# Altium schematic sheet Logic_IO_Protection.SchDoc
size 420 x 297 mm; SheetNumber: 4; SheetTotal: 5
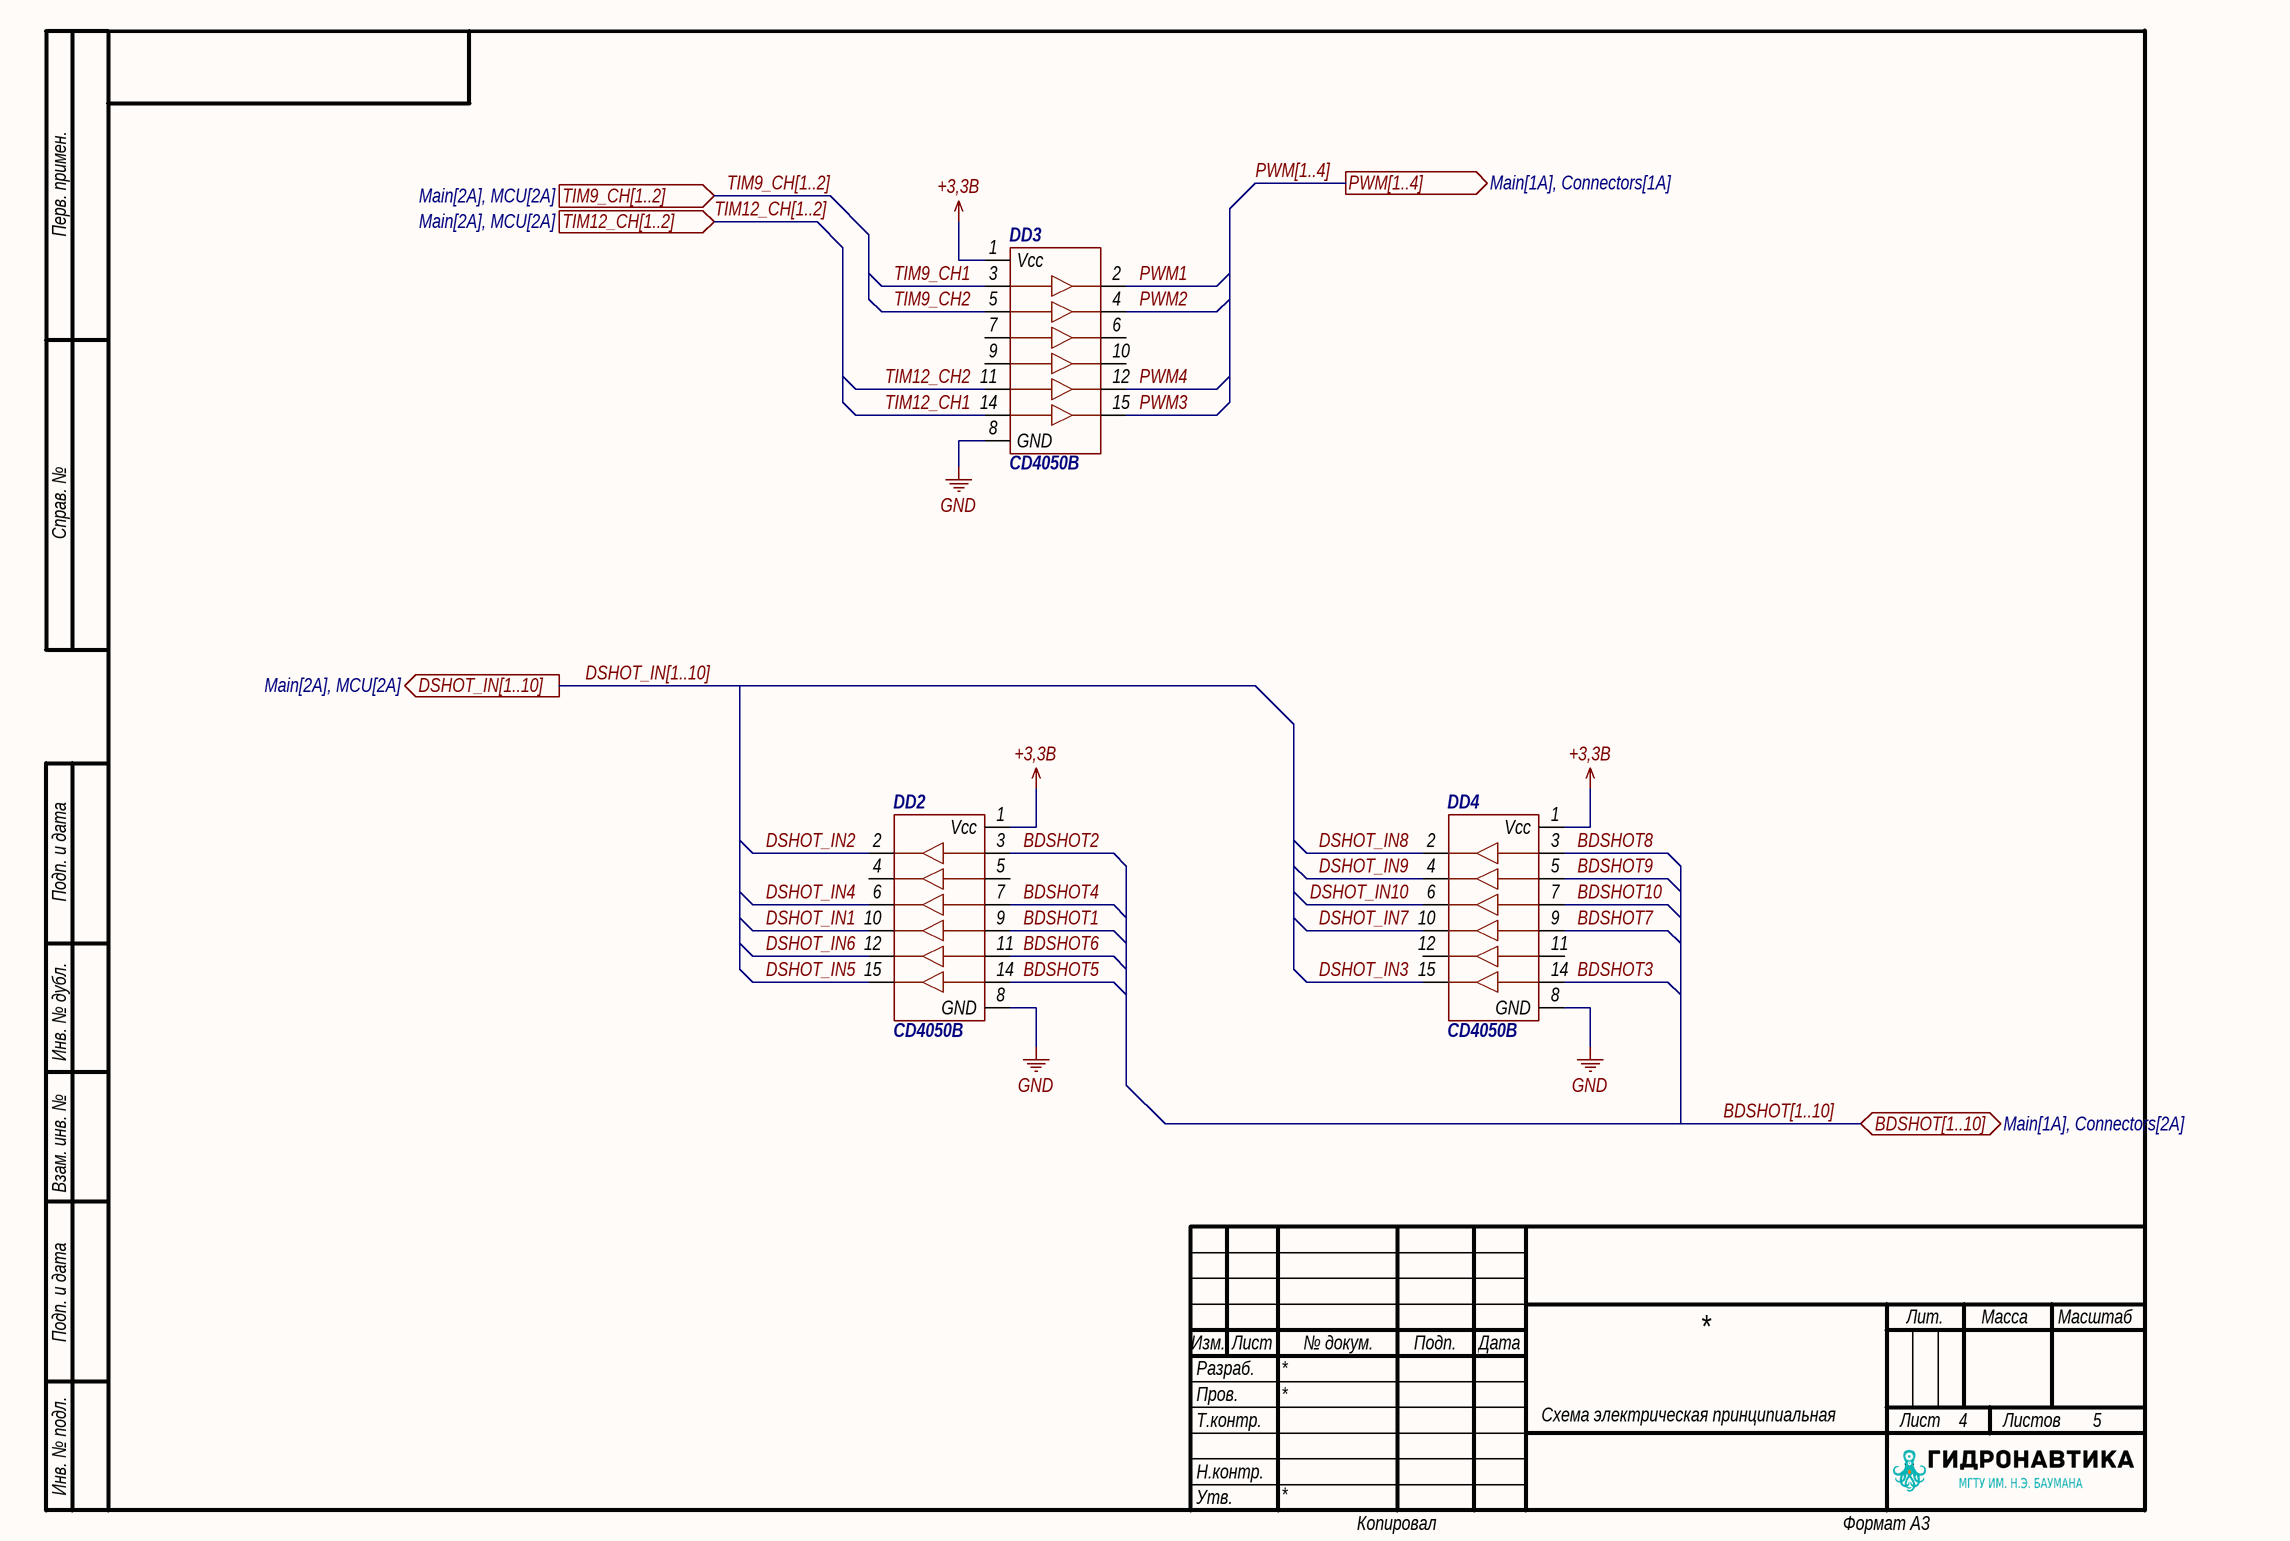
[diagram p0: Logic_IO_Protection.SchDoc]

## Parts
DD2  CD4050B  [SOIC-16]
DD3  CD4050B  [SOIC-16]
DD4  CD4050B  [SOIC-16]

## Ports
BDSHOT[1..10] (bidir, see Main[1A], Connectors[2A]), DSHOT_IN[1..10] (out, see Main[2A], MCU[2A]), PWM[1..4] (out, see Main[1A], Connectors[1A]), TIM9_CH[1..2] (in, see Main[2A], MCU[2A]), TIM12_CH[1..2] (in, see Main[2A], MCU[2A])

## Nets
+3,3В: DD2.1(Vcc) DD3.1(Vcc) DD4.1(Vcc)
GND: DD2.8(GND) DD3.8(GND) DD4.8(GND)
BDSHOT1: DD2.9(A4)
BDSHOT2: DD2.3(A1)
BDSHOT3: DD4.14(A6)
BDSHOT4: DD2.7(A3)
BDSHOT5: DD2.14(A6)
BDSHOT6: DD2.11(A5)
BDSHOT7: DD4.9(A4)
BDSHOT8: DD4.3(A1)
BDSHOT9: DD4.5(A2)
BDSHOT10: DD4.7(A3)
DSHOT_IN1: DD2.10(Y10)
DSHOT_IN2: DD2.2(Y1)
DSHOT_IN3: DD4.15(Y6)
DSHOT_IN4: DD2.6(Y3)
DSHOT_IN5: DD2.15(Y6)
DSHOT_IN6: DD2.12(Y5)
DSHOT_IN7: DD4.10(Y10)
DSHOT_IN8: DD4.2(Y1)
DSHOT_IN9: DD4.4(Y2)
DSHOT_IN10: DD4.6(Y3)
PWM1: DD3.2(Y1)
PWM2: DD3.4(Y2)
PWM3: DD3.15(Y6)
PWM4: DD3.12(Y5)
TIM9_CH1: DD3.3(A1)
TIM9_CH2: DD3.5(A2)
TIM12_CH1: DD3.14(A6)
TIM12_CH2: DD3.11(A5)

Not connected (* = marked no-connect by the designer): DD2 4(Y2) 5(A2); DD3 6(Y3) 7(A3) 9(A4) 10(Y10); DD4 11(A5) 12(Y5)

## Buses and harness runs
bus BDSHOT[1..10] = port BDSHOT[1..10]
bus DSHOT_IN[1..10] = port DSHOT_IN[1..10]
bus PWM[1..4] = port PWM[1..4]
bus TIM9_CH[1..2] = port TIM9_CH[1..2]
bus TIM12_CH[1..2] = port TIM12_CH[1..2]

## Notes on the sheet
- Перв. примен.
- Справ. №
- Подп. и дата
- Инв. № дубл.
- Взам. инв. №
- Разраб.
- Изм.
- Лист
- № докум.
- Подп.
- Дата
- Лит.
- Масса
- Масштаб
- Пров.
- Т.контр.
- Схема электрическая принципиальная
- Листов
- Инв. № подл.
- Утв.
- Н.контр.
- Копировал
- Формат А3

## Library data of the parts
DD2-DD4 = CD4050B: Шесть буферных элементов; Part Number: CD4050B